# EAGLE design X13_Power_Distribution (EAGLE 9.6.2)
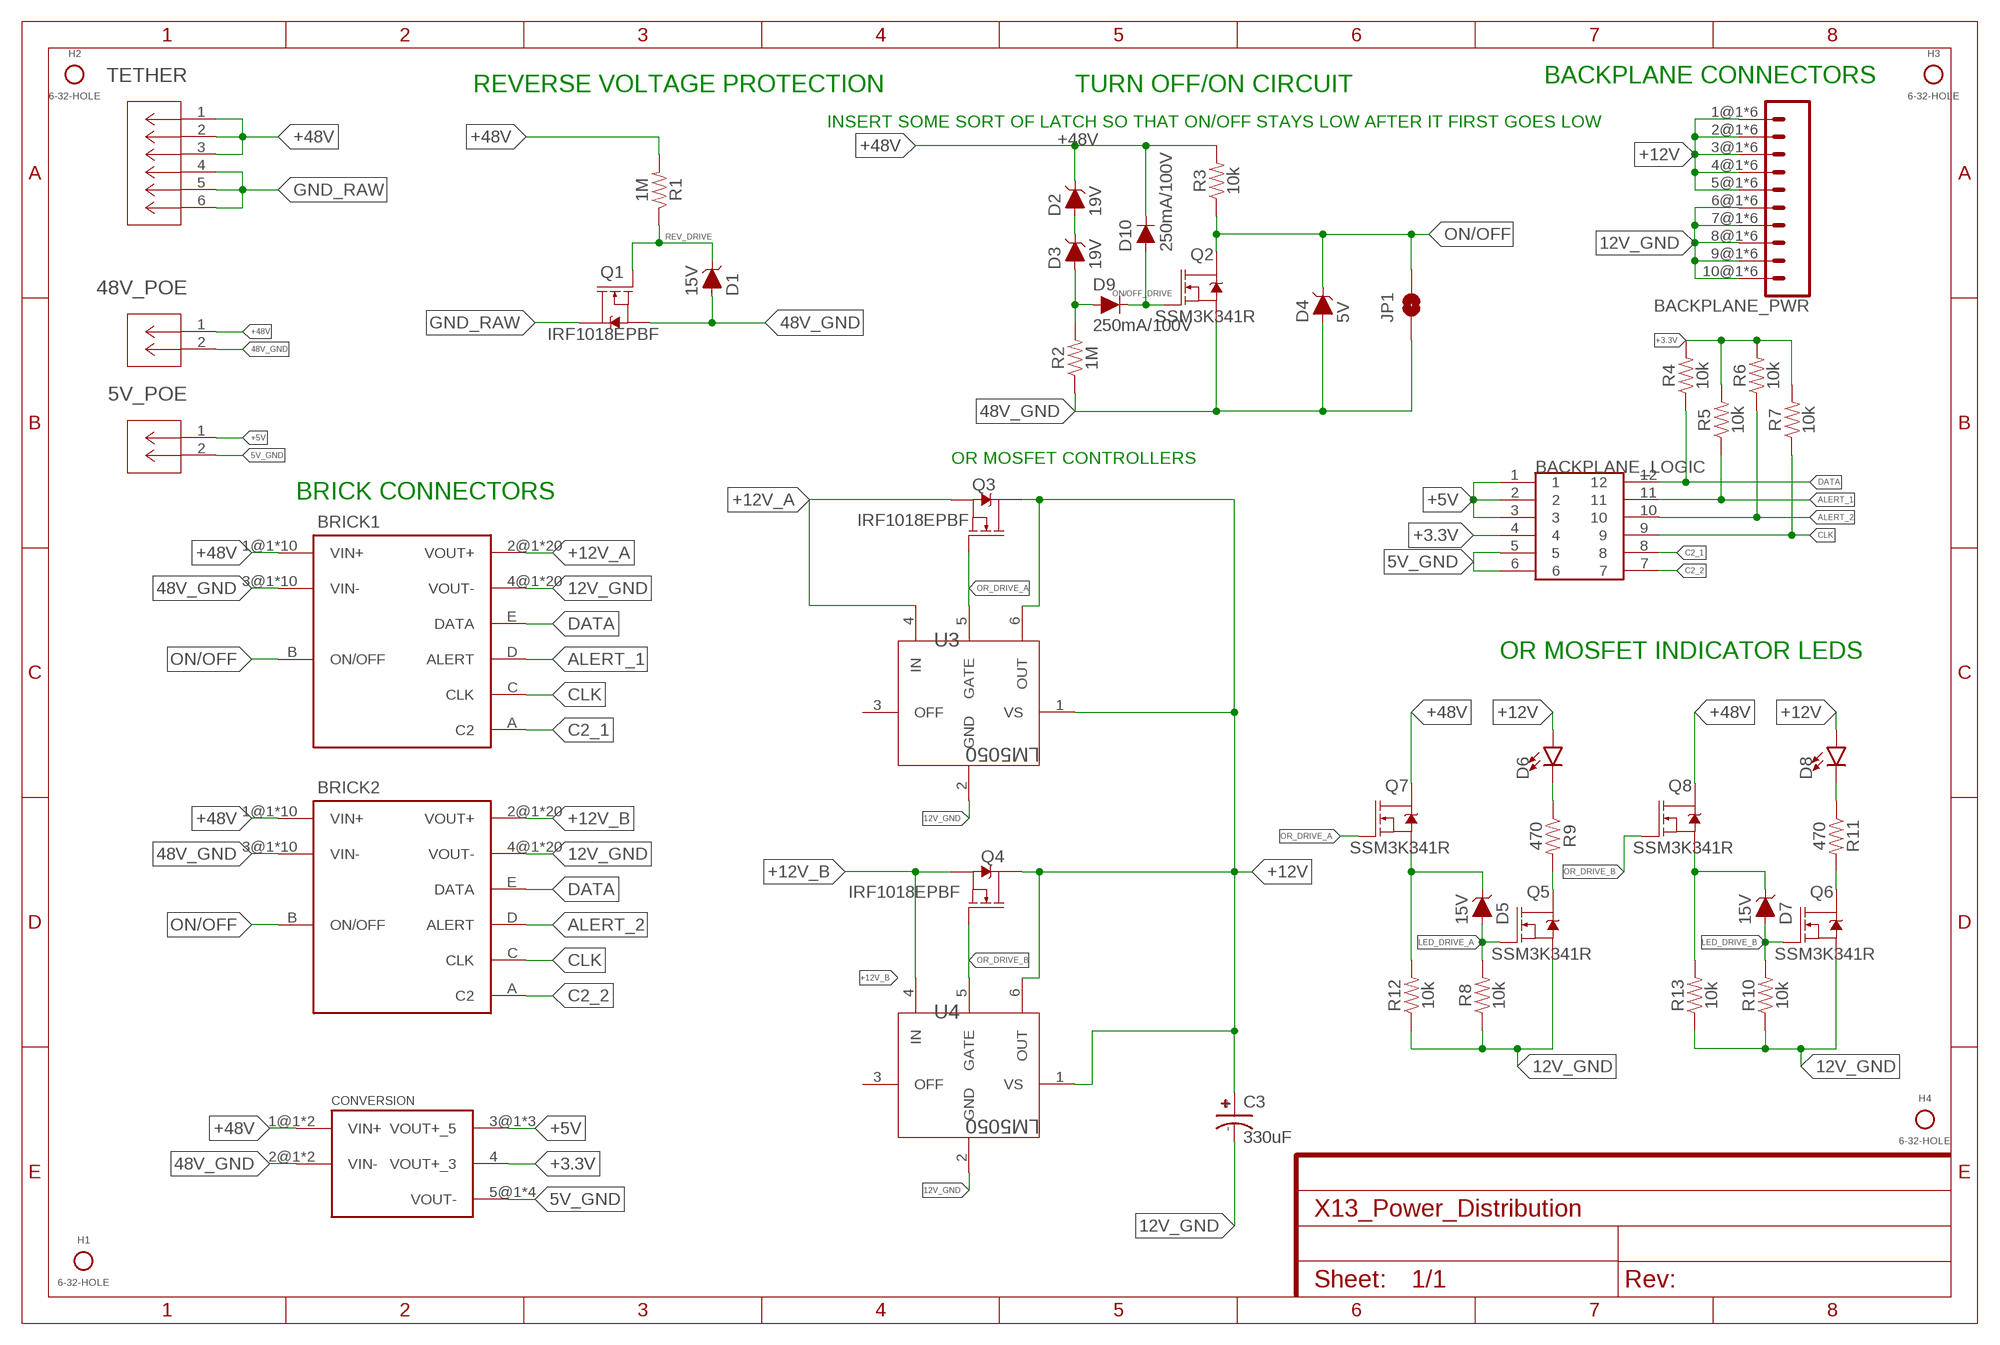
[diagram p0: schematic, sheet 1, part 1 of 2]
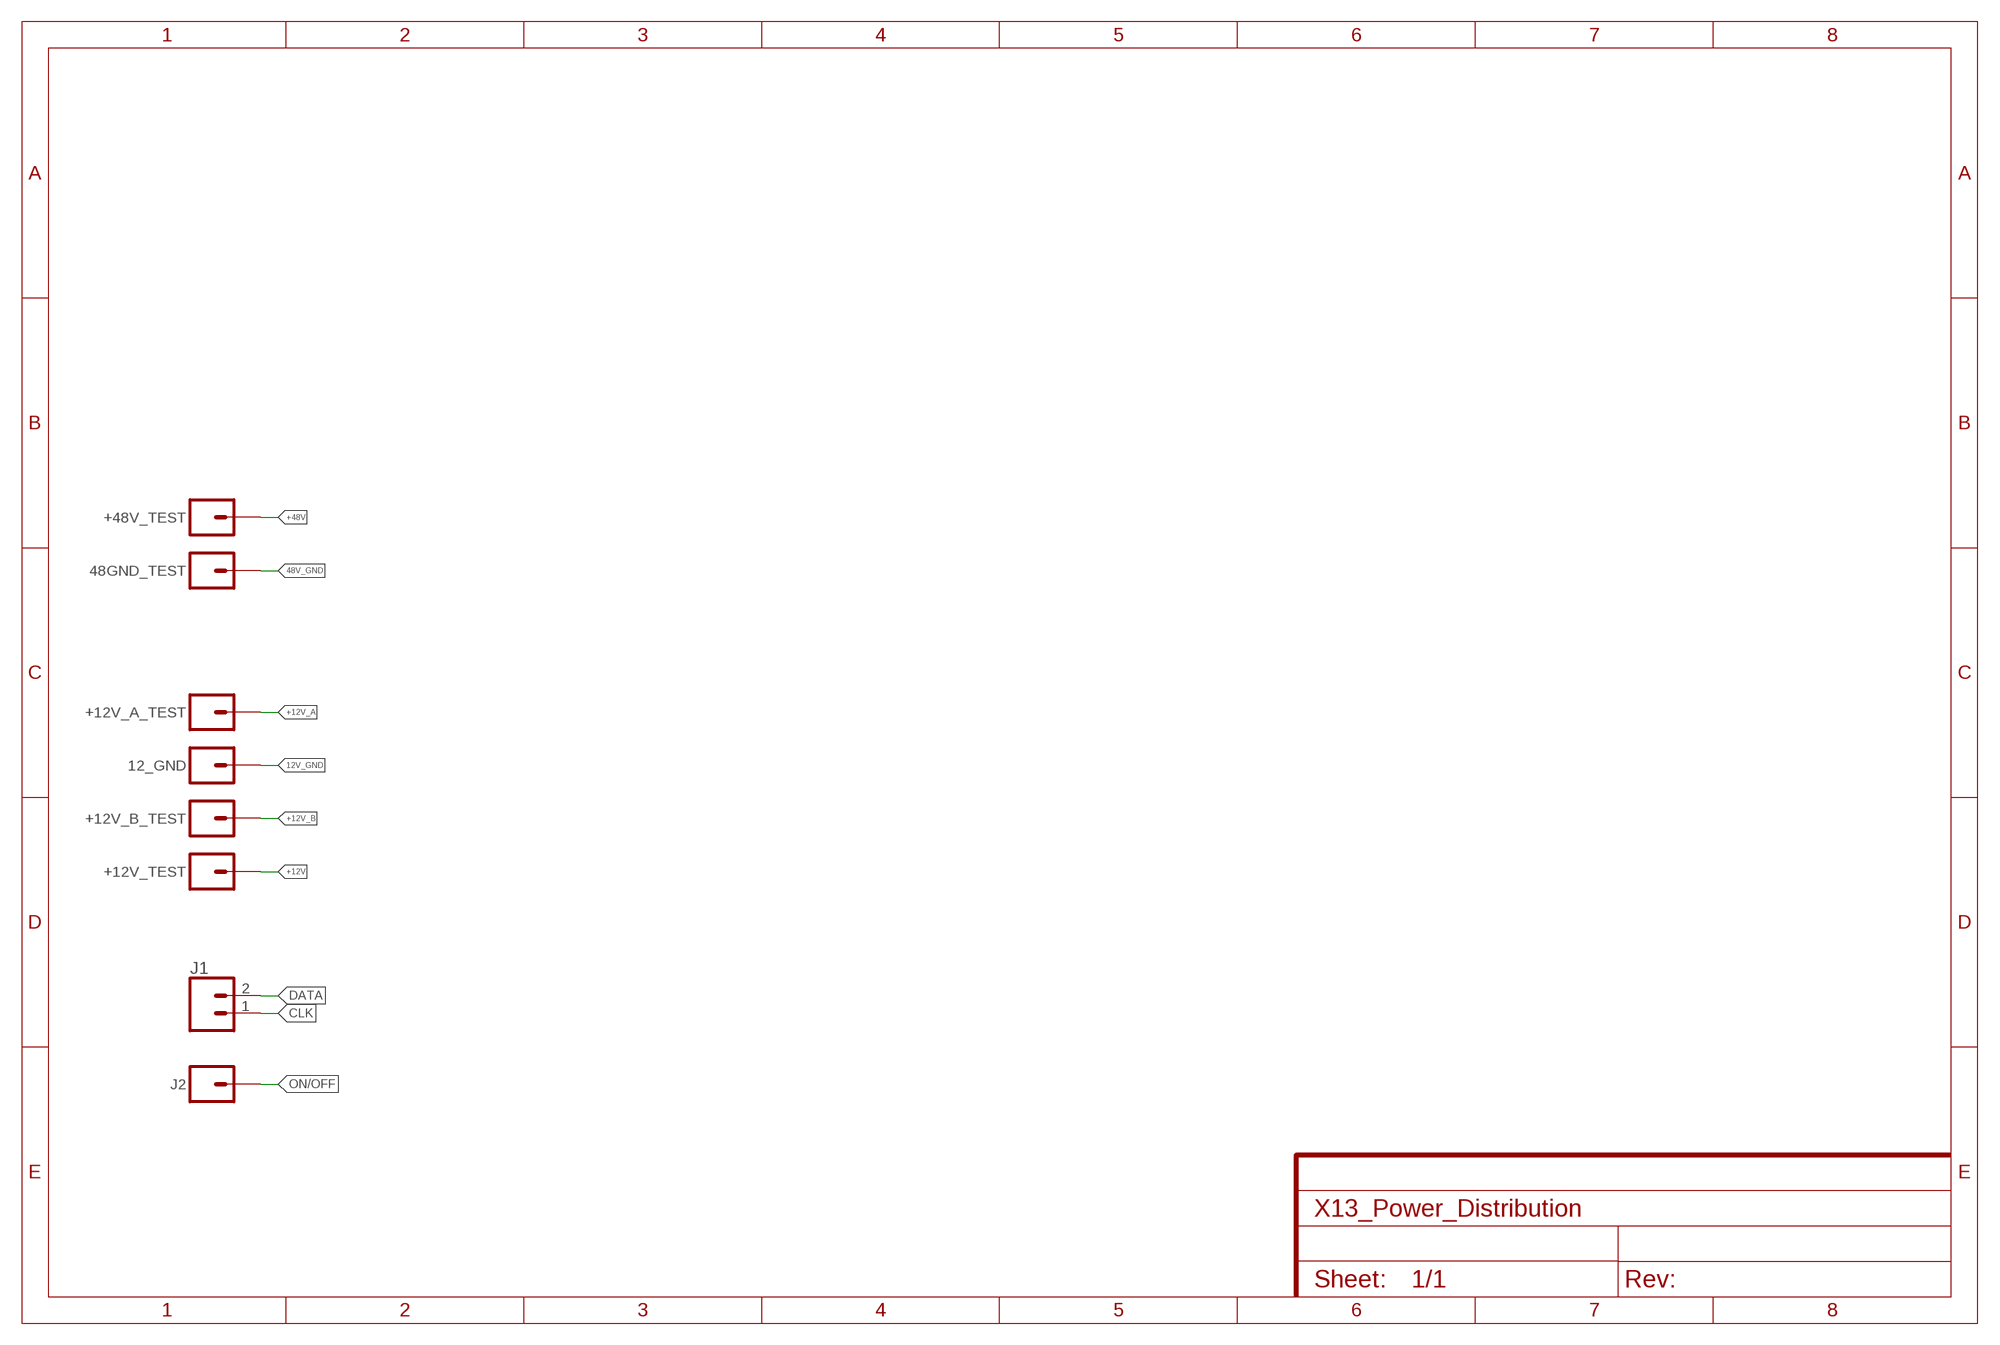
[diagram p1: schematic, sheet 1, part 2 of 2]

## Parts
5V_POE  POE_TERMINAL  [CONN2_282834-2_TEC]
12_GND  CONN_01  [1X01]
48GND_TEST  CONN_01  [1X01]
48V_POE  POE_TERMINAL  [CONN2_282834-2_TEC]
+12V_A_TEST  CONN_01  [1X01]
+12V_B_TEST  CONN_01  [1X01]
+12V_TEST  CONN_01  [1X01]
+48V_TEST  CONN_01  [1X01]
BACKPLANE_LOGIC  IPL1-106-01-L-D-K  [IPL1-106-01-L-D-K]
BACKPLANE_PWR  MPPT-10-01-01-L-RA-SD  [MPPT-10-01-01-L-RA-SD]
BRICK1  DIST2BRICKVER_D2  [DIST2BRICK_D2]
BRICK2  DIST2BRICKVER_D2  [DIST2BRICK_D2]
C3  330uF  UCM1H331MNL1GS  [CAPAE1030X1050N]
CONVERSION  DIST2CON  [DIST2CON]
D1  15V  DIODE-ZENER-BZT52C3V6S  [SOD-323]
D2  19V  DIODE-ZENER-BZT52C3V6S  [SOD-323]
D3  19V  DIODE-ZENER-BZT52C3V6S  [SOD-323]
D4  5V  DIODE-ZENER-BZT52C3V6S  [SOD-323]
D5  15V  DIODE-ZENER-BZT52C3V6S  [SOD-323]
D6  LED0603  [LED-0603]
D7  15V  DIODE-ZENER-BZT52C3V6S  [SOD-323]
D8  LED0603  [LED-0603]
D9  250mA/100V  DIODE-BAS16J  [SOD-323]
D10  250mA/100V  DIODE-BAS16J  [SOD-323]
H1  6-32-HOLE  [6-32-HOLE]
H2  6-32-HOLE  [6-32-HOLE]
H3  6-32-HOLE  [6-32-HOLE]
H4  6-32-HOLE  [6-32-HOLE]
J1  CONN_02  [1X02]
J2  CONN_01  [1X01]
JP1  JUMPER-SMT_2_NO_SILK  [SMT-JUMPER_2_NO_SILK]
Q1  IRF1018EPBF  [TO263]
Q2  SSM3K341R  MOSFET-NCH-2N7002PW  [SOT323]
Q3  IRF1018EPBF  [TO263]
Q4  IRF1018EPBF  [TO263]
Q5  SSM3K341R  MOSFET-NCH-2N7002PW  [SOT323]
Q6  SSM3K341R  MOSFET-NCH-2N7002PW  [SOT323]
Q7  SSM3K341R  MOSFET-NCH-2N7002PW  [SOT323]
Q8  SSM3K341R  MOSFET-NCH-2N7002PW  [SOT323]
R1  1M  RESISTOR0603  [0603]
R2  1M  RESISTOR0603  [0603]
R3  10k  RESISTOR0603  [0603]
R4  10k  RESISTOR0603  [0603]
R5  10k  RESISTOR0603  [0603]
R6  10k  RESISTOR0603  [0603]
R7  10k  RESISTOR0603  [0603]
R8  10k  RESISTOR0603  [0603]
R9  470  RESISTOR0603  [0603]
R10  10k  RESISTOR0603  [0603]
R11  470  RESISTOR0603  [0603]
R12  10k  RESISTOR0603  [0603]
R13  10k  RESISTOR0603  [0603]
TETHER  48V  DIST_TO_TETHER  [CON6_P5MM_VER_TERM-BLK_TYC]
U3  LM5050  DIST_OR_CONTROL_ALTMK06A-M  [SOT-23-6]
U4  LM5050  DIST_OR_CONTROL_ALTMK06A-M  [SOT-23-6]

## Nets
5V_GND: 5V_POE.2 BACKPLANE_LOGIC.5 BACKPLANE_LOGIC.6 CONVERSION.5@1(VOUT-) CONVERSION.5@2(VOUT-) CONVERSION.5@3(VOUT-) CONVERSION.5@4(VOUT-)
12V_GND: 12_GND.1 BACKPLANE_PWR.6@1 BACKPLANE_PWR.6@2 BACKPLANE_PWR.6@3 BACKPLANE_PWR.6@4 BACKPLANE_PWR.6@5 BACKPLANE_PWR.6@6 BACKPLANE_PWR.7@1 BACKPLANE_PWR.7@2 BACKPLANE_PWR.7@3 BACKPLANE_PWR.7@4 BACKPLANE_PWR.7@5 BACKPLANE_PWR.7@6 BACKPLANE_PWR.8@1 BACKPLANE_PWR.8@2 BACKPLANE_PWR.8@3 BACKPLANE_PWR.8@4 BACKPLANE_PWR.8@5 BACKPLANE_PWR.8@6 BACKPLANE_PWR.9@1 BACKPLANE_PWR.9@2 BACKPLANE_PWR.9@3 BACKPLANE_PWR.9@4 BACKPLANE_PWR.9@5 BACKPLANE_PWR.9@6 BACKPLANE_PWR.10@1 BACKPLANE_PWR.10@2 BACKPLANE_PWR.10@3 BACKPLANE_PWR.10@4 BACKPLANE_PWR.10@5 BACKPLANE_PWR.10@6 BRICK1.4@1(VOUT-) BRICK1.4@2(VOUT-) BRICK1.4@3(VOUT-) BRICK1.4@4(VOUT-) BRICK1.4@5(VOUT-) BRICK1.4@6(VOUT-) BRICK1.4@7(VOUT-) BRICK1.4@8(VOUT-) BRICK1.4@9(VOUT-) BRICK1.4@10(VOUT-) BRICK1.4@11(VOUT-) BRICK1.4@12(VOUT-) BRICK1.4@13(VOUT-) BRICK1.4@14(VOUT-) BRICK1.4@15(VOUT-) BRICK1.4@16(VOUT-) BRICK1.4@17(VOUT-) BRICK1.4@18(VOUT-) BRICK1.4@19(VOUT-) BRICK1.4@20(VOUT-) BRICK2.4@1(VOUT-) BRICK2.4@2(VOUT-) BRICK2.4@3(VOUT-) BRICK2.4@4(VOUT-) BRICK2.4@5(VOUT-) BRICK2.4@6(VOUT-) BRICK2.4@7(VOUT-) BRICK2.4@8(VOUT-) BRICK2.4@9(VOUT-) BRICK2.4@10(VOUT-) BRICK2.4@11(VOUT-) BRICK2.4@12(VOUT-) BRICK2.4@13(VOUT-) BRICK2.4@14(VOUT-) BRICK2.4@15(VOUT-) BRICK2.4@16(VOUT-) BRICK2.4@17(VOUT-) BRICK2.4@18(VOUT-) BRICK2.4@19(VOUT-) BRICK2.4@20(VOUT-) C3.- Q5.2(S) Q6.2(S) R8.1 R10.1 R12.1 R13.1 U3.2(GND) U4.2(GND)
48V_GND: 48GND_TEST.1 48V_POE.2 BRICK1.3@1(VIN-) BRICK1.3@2(VIN-) BRICK1.3@3(VIN-) BRICK1.3@4(VIN-) BRICK1.3@5(VIN-) BRICK1.3@6(VIN-) BRICK1.3@7(VIN-) BRICK1.3@8(VIN-) BRICK1.3@9(VIN-) BRICK1.3@10(VIN-) BRICK2.3@1(VIN-) BRICK2.3@2(VIN-) BRICK2.3@3(VIN-) BRICK2.3@4(VIN-) BRICK2.3@5(VIN-) BRICK2.3@6(VIN-) BRICK2.3@7(VIN-) BRICK2.3@8(VIN-) BRICK2.3@9(VIN-) BRICK2.3@10(VIN-) CONVERSION.2@1(VIN-) CONVERSION.2@2(VIN-) D1.A D4.A JP1.1 Q1.2(S) Q2.2(S) R2.1
+3.3V: BACKPLANE_LOGIC.4 CONVERSION.4(VOUT+_3) R4.2 R5.2 R6.2 R7.2
+5V: 5V_POE.1 BACKPLANE_LOGIC.1 BACKPLANE_LOGIC.2 BACKPLANE_LOGIC.3 CONVERSION.3@1(VOUT+_5) CONVERSION.3@2(VOUT+_5) CONVERSION.3@3(VOUT+_5)
+12V: +12V_TEST.1 BACKPLANE_PWR.1@1 BACKPLANE_PWR.1@2 BACKPLANE_PWR.1@3 BACKPLANE_PWR.1@4 BACKPLANE_PWR.1@5 BACKPLANE_PWR.1@6 BACKPLANE_PWR.2@1 BACKPLANE_PWR.2@2 BACKPLANE_PWR.2@3 BACKPLANE_PWR.2@4 BACKPLANE_PWR.2@5 BACKPLANE_PWR.2@6 BACKPLANE_PWR.3@1 BACKPLANE_PWR.3@2 BACKPLANE_PWR.3@3 BACKPLANE_PWR.3@4 BACKPLANE_PWR.3@5 BACKPLANE_PWR.3@6 BACKPLANE_PWR.4@1 BACKPLANE_PWR.4@2 BACKPLANE_PWR.4@3 BACKPLANE_PWR.4@4 BACKPLANE_PWR.4@5 BACKPLANE_PWR.4@6 BACKPLANE_PWR.5@1 BACKPLANE_PWR.5@2 BACKPLANE_PWR.5@3 BACKPLANE_PWR.5@4 BACKPLANE_PWR.5@5 BACKPLANE_PWR.5@6 C3.+ D6.A D8.A Q3.3(D) Q4.3(D) U3.1(VS) U3.6(OUT) U4.1(VS) U4.6(OUT)
+12V_A: +12V_A_TEST.1 BRICK1.2@1(VOUT+) BRICK1.2@2(VOUT+) BRICK1.2@3(VOUT+) BRICK1.2@4(VOUT+) BRICK1.2@5(VOUT+) BRICK1.2@6(VOUT+) BRICK1.2@7(VOUT+) BRICK1.2@8(VOUT+) BRICK1.2@9(VOUT+) BRICK1.2@10(VOUT+) BRICK1.2@11(VOUT+) BRICK1.2@12(VOUT+) BRICK1.2@13(VOUT+) BRICK1.2@14(VOUT+) BRICK1.2@15(VOUT+) BRICK1.2@16(VOUT+) BRICK1.2@17(VOUT+) BRICK1.2@18(VOUT+) BRICK1.2@19(VOUT+) BRICK1.2@20(VOUT+) Q3.2(S) U3.4(IN)
+12V_B: +12V_B_TEST.1 BRICK2.2@1(VOUT+) BRICK2.2@2(VOUT+) BRICK2.2@3(VOUT+) BRICK2.2@4(VOUT+) BRICK2.2@5(VOUT+) BRICK2.2@6(VOUT+) BRICK2.2@7(VOUT+) BRICK2.2@8(VOUT+) BRICK2.2@9(VOUT+) BRICK2.2@10(VOUT+) BRICK2.2@11(VOUT+) BRICK2.2@12(VOUT+) BRICK2.2@13(VOUT+) BRICK2.2@14(VOUT+) BRICK2.2@15(VOUT+) BRICK2.2@16(VOUT+) BRICK2.2@17(VOUT+) BRICK2.2@18(VOUT+) BRICK2.2@19(VOUT+) BRICK2.2@20(VOUT+) Q4.2(S) U4.4(IN)
+48V: 48V_POE.1 +48V_TEST.1 BRICK1.1@1(VIN+) BRICK1.1@2(VIN+) BRICK1.1@3(VIN+) BRICK1.1@4(VIN+) BRICK1.1@5(VIN+) BRICK1.1@6(VIN+) BRICK1.1@7(VIN+) BRICK1.1@8(VIN+) BRICK1.1@9(VIN+) BRICK1.1@10(VIN+) BRICK2.1@1(VIN+) BRICK2.1@2(VIN+) BRICK2.1@3(VIN+) BRICK2.1@4(VIN+) BRICK2.1@5(VIN+) BRICK2.1@6(VIN+) BRICK2.1@7(VIN+) BRICK2.1@8(VIN+) BRICK2.1@9(VIN+) BRICK2.1@10(VIN+) CONVERSION.1@1(VIN+) CONVERSION.1@2(VIN+) D2.C D10.C Q7.3(D) Q8.3(D) R1.2 R3.2 TETHER.1 TETHER.2 TETHER.3
ALERT_1: BACKPLANE_LOGIC.11 BRICK1.D(ALERT) R5.1
ALERT_2: BACKPLANE_LOGIC.10 BRICK2.D(ALERT) R6.1
C2_1: BACKPLANE_LOGIC.8 BRICK1.A(C2)
C2_2: BACKPLANE_LOGIC.7 BRICK2.A(C2)
CLK: BACKPLANE_LOGIC.9 BRICK1.C(CLK) BRICK2.C(CLK) J1.1 R7.1
DATA: BACKPLANE_LOGIC.12 BRICK1.E(DATA) BRICK2.E(DATA) J1.2 R4.1
GND_RAW: Q1.3(D) TETHER.4 TETHER.5 TETHER.6
LED_DRIVE_A: D5.A Q5.1(G) R8.2
LED_DRIVE_B: D7.A Q6.1(G) R10.2
N$1: D2.A D3.C
N$2: D5.C Q7.2(S) R12.2
N$3: D7.C Q8.2(S) R13.2
N$4: Q5.3(D) R9.2
N$5: D6.C R9.1
N$6: Q6.3(D) R11.2
N$7: D8.C R11.1
ON/OFF: BRICK1.B(ON/OFF) BRICK2.B(ON/OFF) D4.C J2.1 JP1.2 Q2.3(D) R3.1
ON/OFF_DRIVE: D9.C D10.A Q2.1(G)
ON_DETECT: D3.A D9.A R2.2
OR_DRIVE_A: Q3.1(G) Q7.1(G) U3.5(GATE)
OR_DRIVE_B: Q4.1(G) Q8.1(G) U4.5(GATE)
REV_DRIVE: D1.C Q1.1(G) R1.1
Unconnected: U3.3(OFF) U4.3(OFF)

## Notes on the sheet
- BACKPLANE CONNECTORS
- REVERSE VOLTAGE PROTECTION | TURN OFF/ON CIRCUIT
- INSERT SOME SORT OF LATCH SO THAT ON/OFF STAYS LOW AFTER IT FIRST GOES LOW
- OR MOSFET CONTROLLERS
- BRICK CONNECTORS
- OR MOSFET INDICATOR LEDS

## Library data of the parts
5V_POE 48V_POE = Dist_POE:POE_TERMINAL; BUILT_BY: EMA_UL_Team; COPYRIGHT: Copyright (C) 2016 Accelerated Designs. All rights reserved; DESCRIPTION: TERMI-BLOK PCB MOUNT, 90 2P.; MANUFACTURER_PART_NUMBER: 282834-2; PITCH_MM_: 2.54; POSITIONS: 2; PRODUCT: Terminal Block Headers & Receptacles; ROWS-CONFIG: 1; SOURCELIBRARY: TE_Connectivity-2018-03-16; TE_PART_NUMBER: 282834-2; TYPE: Receptacle; VENDOR: TE Connectivity
12_GND 48GND_TEST +12V_A_TEST +12V_B_TEST +12V_TEST +48V_TEST J2 = SparkFun-Connectors:CONN_01: Single connection point. Often used as Generic Header-pin footprint for 0.1 inch spaced/style header connections On any of the 0.1 inch spaced packages, you can populate with these: Break Away Headers - Straight <https://www.sparkfun.com/products/116> (PRT-00116) Break Away Male Headers - Right Angle <https://www.sparkfun.com/products/553> (PRT-00553) Female Headers <https://www.sparkfun.com/products/115> (PRT-00115) Break Away Headers - Machine Pin <https://www.sparkfun.com/products/117> (PRT-00117) Break Away Female Headers - Swiss Machine Pin <https://www.sparkfun.com/products/743> (PRT-00743) This device is also useful as a general connection point to wire up your design to another part of your project. Our various solder wires solder well into these plated through hole pads. Hook-Up Wire - Assortment (Stranded, 22 AWG) <https://www.sparkfun.com/products/11375> (PRT-11375) Hook-Up Wire - Assortment (Solid Core, 22 AWG) <https://www.sparkfun.com/products/11367> (PRT-11367) View the entire wire category on our website here <https://www.sparkfun.com/categories/141> Special notes: SMTSO-256-ET is a "flush mount" nut for a 4-40 screw. We mostly use this on specialty testbeds; it is a nice way to connect hardware to your PCB at an adjustable hieght. Also note, the SNAP packages are for using a snappable style connector. We sell a baggie of snaps and they are also used on two LilyPad designs: Snap Assortment - 30 pack (male and female) <https://www.sparkfun.com/products/11347> (DEV-11347) LilyPad Arduino SimpleSnap <https://www.sparkfun.com/products/10941> (DEV-10941) LilyPad SimpleSnap Protoboard <https://www.sparkfun.com/products/10940> (DEV-10940)
BACKPLANE_LOGIC = Backplane_Dist_Logic_Connector:IPL1-106-01-L-D-K
BACKPLANE_PWR = Samtec MPPT Hermaphoditic 10 pos - MPPT-10-01-01-L-RA-SD:MPPT-10-01-01-L-RA-SD: Samtec MPPT Connector Right Angle Vertically mating Non-gendered https://www.samtec.com/products/mppt-10-01-01-l-ra-sd
BRICK1 BRICK2 = Brick_Dist_Connector:DIST2BRICK
C3 = brick-capacitor-UCM1H331MNL1GS:UCM1H331MNL1GS: Nichicon 330uF 50 V Aluminium Electrolytic Capacitor SMD, CM Series 2000h 10 (Dia.) x 10mm Source: Datasheet <http://www.nichicon.co.jp/english/products/pdfs/e-ucm.pdf>; ARROW_PART_NUMBER: UCM1H331MNL1GS; ARROW_PRICE-STOCK: https://www.arrow.com/en/products/ucm1h331mnl1gs/nichicon; DESCRIPTION: Nichicon 330uF 50 V Aluminium Electrolytic Capacitor SMD, CM Series 2000h 10 (Dia.) x 10mm; HEIGHT: 10.5mm; MANUFACTURER_NAME: Nichicon; MANUFACTURER_PART_NUMBER: UCM1H331MNL1GS; MOUSER_PART_NUMBER: 647-UCM1H331MNL1GS; MOUSER_PRICE-STOCK: https://www.mouser.co.uk/ProductDetail/Nichicon/UCM1H331MNL1GS?qs=DSgADHjnLTkTovFLdbC%252BNg%3D%3D
CONVERSION = Dist_Convert_Connector:DIST2CON
D1-D5 D7 = SparkFun-DiscreteSemi:DIODE-ZENER: Zener Diode A Zener diode allows current to flow from its anode to its cathode like a normal semiconductor diode, but it also permits current to flow in the reverse direction when its "Zener voltage" is reached. - WIkipedia; PROD_ID: DIO-08199; VALUE: 3.6V
D6 D8 = SparkFun-LED:LED: LED (Generic) Standard schematic elements and footprints for 5mm, 3mm, 1206, and 0603 sized LEDs. Generic LEDs with no color specified.
D9 D10 = SparkFun-DiscreteSemi:DIODE: Diode These are standard reverse protection diodes and small signal diodes. SparkFun Products: SparkFun SparkPunk Sound Kit <https://www.sparkfun.com/products/11177> SparkFun ESP8266 Thing <https://www.sparkfun.com/products/13231>; PROD_ID: DIO-09646
H1-H4 = Mounting Holes:6-32-HOLE
J1 = SparkFun-Connectors:CONN_02: Multi connection point. Often used as Generic Header-pin footprint for 0.1 inch spaced/style header connections On any of the 0.1 inch spaced packages, you can populate with these: Break Away Headers - Straight <https://www.sparkfun.com/products/116> (PRT-00116) Break Away Male Headers - Right Angle <https://www.sparkfun.com/products/553> (PRT-00553) Female Headers <https://www.sparkfun.com/products/115> (PRT-00115) Break Away Headers - Machine Pin <https://www.sparkfun.com/products/117> (PRT-00117) Break Away Female Headers - Swiss Machine Pin <https://www.sparkfun.com/products/743> (PRT-00743) For SCREWTERMINALS and SPRING TERMINALS visit here: Screw Terimnals on SparkFun.com <https://www.sparkfun.com/search/results?term=Screw+Terminals> (5mm/3.5mm/2.54mm spacing) This device is also useful as a general connection point to wire up your design to another part of your project. Our various solder wires solder well into these plated through hole pads. Hook-Up Wire - Assortment (Stranded, 22 AWG) <https://www.sparkfun.com/products/11375> (PRT-11375) Hook-Up Wire - Assortment (Solid Core, 22 AWG) <https://www.sparkfun.com/products/11367> (PRT-11367) View the entire wire category on our website here <https://www.sparkfun.com/categories/141> Special notes: Molex polarized connector foot print use with: PRT-08233 with associated crimp pins and housings. 2.54_SCREWTERM for use with PRT-10571. 3.5mm Screw Terminal footprints for PRT-08084 5mm Screw Terminal footprints for use with PRT-08432
JP1 = SparkFun-Jumpers:JUMPER-SMT_2_NO: Normally open jumper This jumper has two pads in close proximity to each other. Apply solder to close the connection. Round pads are easier to solder for beginners, but are a lot larger. SparkFun Product that uses the round pads: SparkFun EL Sequencer <https://www.sparkfun.com/products/12781>
Q1 Q3 Q4 = Dist_Reverse_Voltage_NMOS:IRF1018EPBF
Q2 Q5-Q8 = SparkFun-DiscreteSemi:MOSFET-NCH: N-channel MOSFETs Voltage controlled devices that allow control of high current outputs. SparkFun Products: SparkFun OpenScale <https://www.sparkfun.com/products/13261> SparkFun Digital Sandbox <https://www.sparkfun.com/products/12651> SparkFun Monster Moto Shield <https://www.sparkfun.com/products/10182> SparkFun MOSFET Power Controller <https://www.sparkfun.com/products/11214>; PROD_ID: TRANS-11151; VALUE: 310mA/60V/1.6Ω
R1 R4-R7 R9 R11 = SparkFun-Resistors:RESISTOR: Generic Resistor Package
R2 R3 R8 R10 R12 R13 = SparkFun-Resistors:RESISTOR: Generic Resistor Package; SPICEPREFIX: R
TETHER = Dist_To_Tether_Connector:DIST_TO_TETHER; BUILT_BY: EMA_UL_Team; MANUFACTURER_PART_NUMBER: 796636-6; SOURCELIBRARY: Tyco_2012-04-26; VENDOR: TE Connectivity
U3 U4 = Dist_OR_Controller:DIST_OR_CONTROL_ALT; BASEPN: LM5050-1; DATASHEETURL: http://www.ti.com/lit/ds/symlink/lm5050-1.pdf; DESCRIPTION: High Side OR-ing FET Controller; MANUFACTURER: Texas Instruments; MANUFACTURER_PART_NUMBER: LM5050MK-1/NOPB; NSC_PACKAGEREFERENCE: MK06A; VENDOR: Texas Instruments

## Net classes
0 default: width 0.203 mm, clearance 0.205 mm

## Board
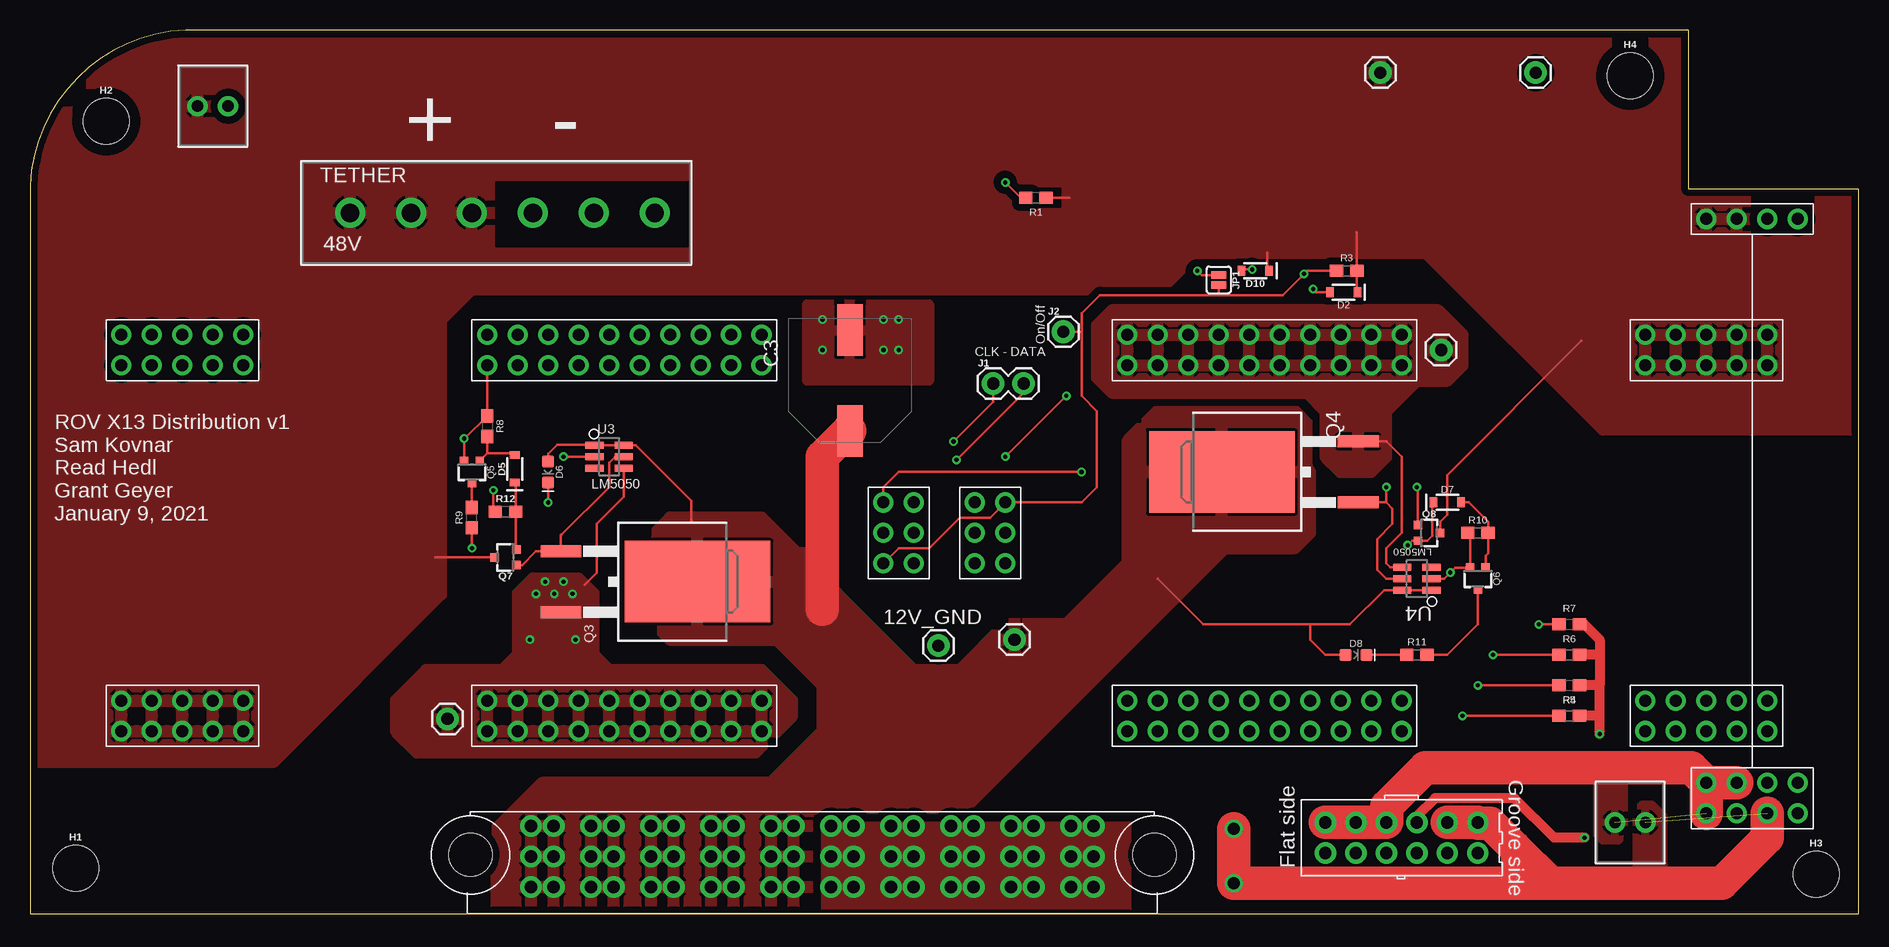
[diagram p2: board, top side]
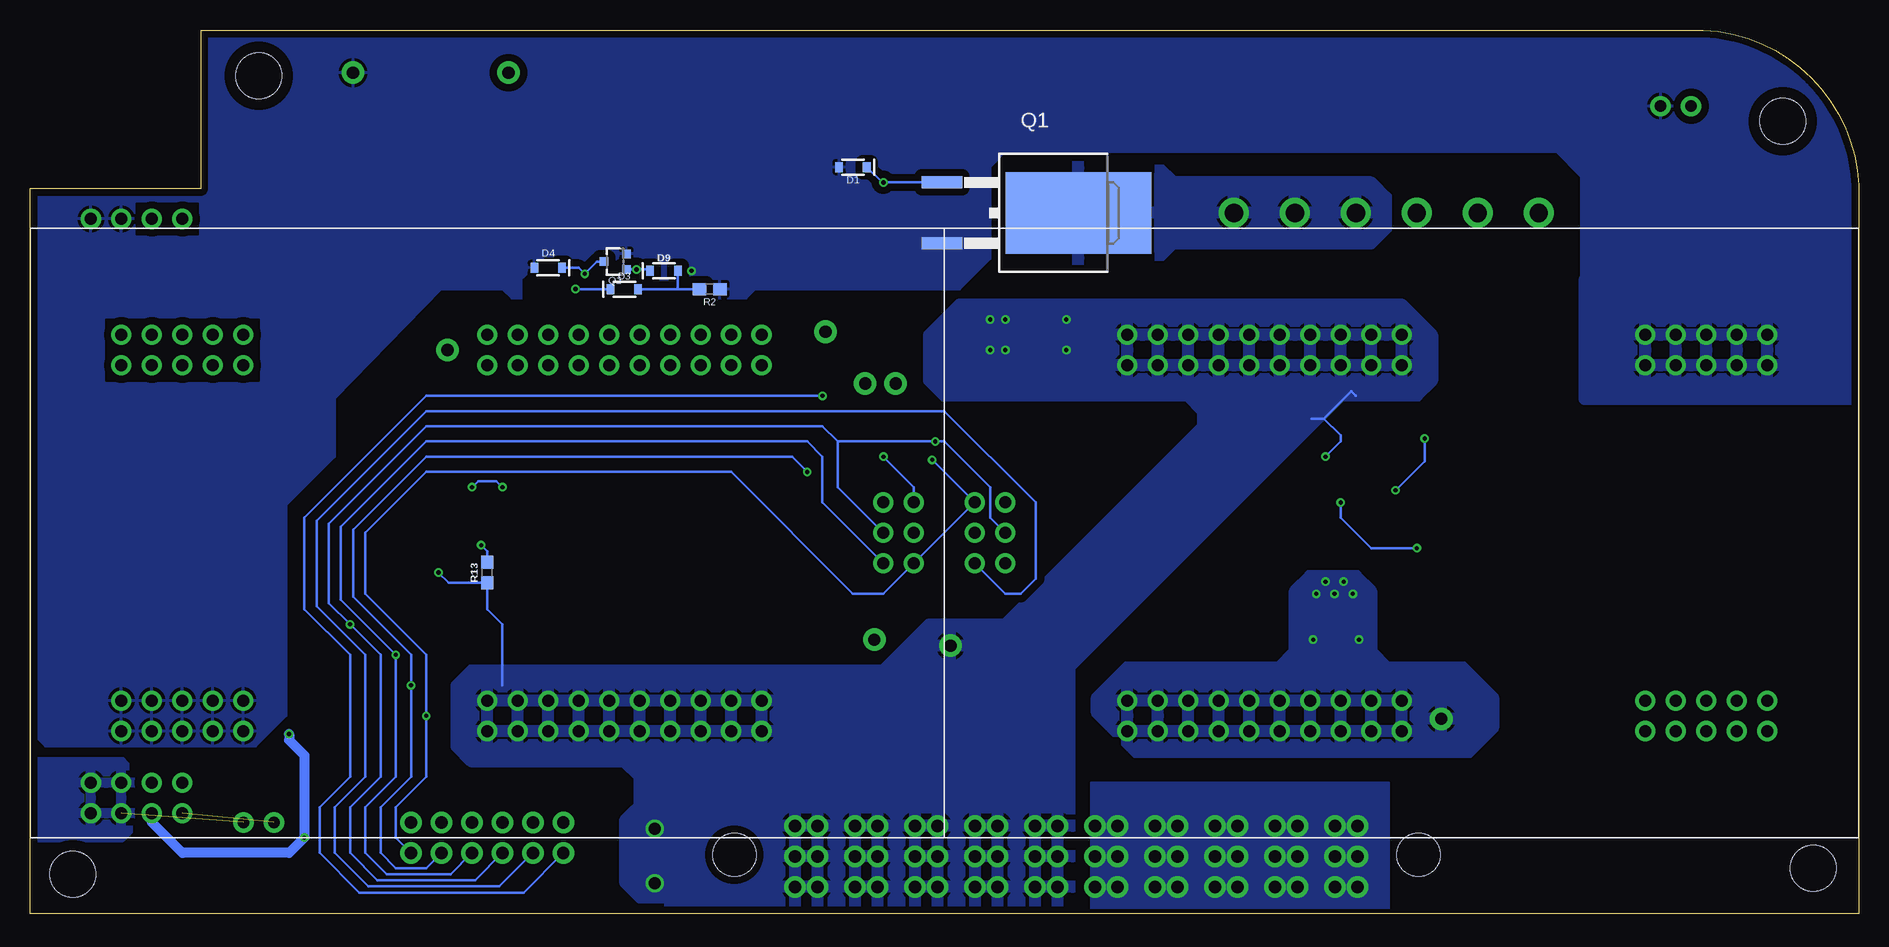
[diagram p3: board, bottom side, seen from below]

Size 152.4 x 73.66 mm. Coordinates in mm from the lower left corner, seen from the top.
Outline: 0,0 152.4,0 152.4,60.45 138.18,60.45 138.18,73.66 14.22,73.66 arc90 0,60.71 0,0
Copper layers (1*16): Top 0.0356mm / dielectric 1.5011mm / Bottom 0.0356mm
Design rules "ECE_Senior_Design": minimum track width 8mil, minimum drill 13mil, track to track 8mil, track to pad 8mil, pad to pad 6mil, via to via 8mil, smd to smd 6mil, copper to edge 15mil, drill to drill 8mil, minimum pad ring 7mil, minimum via ring 7mil, stop-mask expansion 3mil, vias tented up to drill 0mil, thermal gap 10mil

### Footprints (pad centres in the part's own frame; a part is rotated, then mirrored left to right if it is on the bottom)
CONN2_282834-2_TEC = drill 0.965 pad 1.7: 1 0,0; 2 2.54,0
1X01 = drill 1.016 pad 1.88: 1 0,0
IPL1-106-01-L-D-K = drill 1.016 pad 1.778: 1 0,0; 2 2.54,0; 3 5.08,0; 4 7.62,0; 5 10.16,0; 6 12.7,0; 7 0,-2.54; 8 2.54,-2.54; 9 5.08,-2.54; 10 7.62,-2.54; 11 10.16,-2.54; 12 12.7,-2.54
MPPT-10-01-01-L-RA-SD = drill 1.04 pad 1.8: 1@1 -23.44,2.26; 1@2 -21.56,2.26; 1@3 -23.44,4.8; 1@4 -21.56,4.8; 1@5 -23.44,7.34; 1@6 -21.56,7.34; 2@1 -18.44,2.26; 2@2 -16.56,2.26; 2@3 -18.44,4.8; 2@4 -16.56,4.8; 2@5 -18.44,7.34; 2@6 -16.56,7.34; 3@1 -13.44,2.26; 3@2 -11.56,2.26; 3@3 -13.44,4.8; 3@4 -11.56,4.8; 3@5 -13.44,7.34; 3@6 -11.56,7.34; 4@1 -8.44,2.26; 4@2 -6.56,2.26; 4@3 -8.44,4.8; 4@4 -6.56,4.8; 4@5 -8.44,7.34; 4@6 -6.56,7.34; 5@1 -3.44,2.26; 5@2 -1.56,2.26; 5@3 -3.44,4.8; 5@4 -1.56,4.8; 5@5 -3.44,7.34; 5@6 -1.56,7.34; 6@1 1.56,2.26; 6@2 3.44,2.26; 6@3 1.56,4.8; 6@4 3.44,4.8; 6@5 1.56,7.34; 6@6 3.44,7.34; 7@1 6.56,2.26; 7@2 8.44,2.26; 7@3 6.56,4.8; 7@4 8.44,4.8; 7@5 6.56,7.34; 7@6 8.44,7.34; 8@1 11.56,2.26; 8@2 13.44,2.26; 8@3 11.56,4.8; 8@4 13.44,4.8; 8@5 11.56,7.34; 8@6 13.44,7.34; 9@1 16.56,2.26; 9@2 18.44,2.26; 9@3 16.56,4.8; 9@4 18.44,4.8; 9@5 16.56,7.34; 9@6 18.44,7.34; 10@1 21.56,2.26; 10@2 23.44,2.26; 10@3 21.56,4.8; 10@4 23.44,4.8; 10@5 21.56,7.34; 10@6 23.44,7.34 | hole 3.6: 28.5,4.93; -28.5,4.93
DIST2BRICK_D2 = drill 1 pad 1.676: 1@1 -30.48,-16.51; 1@2 -30.48,-13.97; 1@3 -27.94,-16.51; 1@4 -27.94,-13.97; 1@5 -25.4,-16.51; 1@6 -25.4,-13.97; 1@7 -22.86,-16.51; 1@8 -22.86,-13.97; 1@9 -20.32,-16.51; 1@10 -20.32,-13.97; 2@1 0,-16.51; 2@2 0,-13.97; 2@3 2.54,-16.51; 2@4 2.54,-13.97; 2@5 5.08,-16.51; 2@6 5.08,-13.97; 2@7 7.62,-16.51; 2@8 7.62,-13.97; 2@9 10.16,-16.51; 2@10 10.16,-13.97; 2@11 12.7,-16.51; 2@12 12.7,-13.97; 2@13 15.24,-16.51; 2@14 15.24,-13.97; 2@15 17.78,-16.51; 2@16 17.78,-13.97; 2@17 20.32,-13.97; 2@18 22.86,-13.97; 2@19 22.86,-16.51; 2@20 20.32,-16.51; 3@1 -30.48,13.97; 3@2 -30.48,16.51; 3@3 -27.94,13.97; 3@4 -27.94,16.51; 3@5 -25.4,13.97; 3@6 -25.4,16.51; 3@7 -22.86,13.97; 3@8 -22.86,16.51; 3@9 -20.32,13.97; 3@10 -20.32,16.51; 4@1 0,13.97; 4@2 0,16.51; 4@3 2.54,13.97; 4@4 2.54,16.51; 4@5 5.08,13.97; 4@6 5.08,16.51; 4@7 7.62,13.97; 4@8 7.62,16.51; 4@9 10.16,13.97; 4@10 10.16,16.51; 4@11 12.7,13.97; 4@12 12.7,16.51; 4@13 15.24,13.97; 4@14 15.24,16.51; 4@15 17.78,13.97; 4@16 17.78,16.51; 4@17 20.32,16.51; 4@18 22.86,16.51; 4@19 22.86,13.97; 4@20 20.32,13.97; A 35.56,-2.54; B 33.02,-2.54; C 33.02,0; D 33.02,2.54; E 35.56,2.54; F 35.56,0
CAPAE1030X1050N = smd 4.3 x 2.15: + -4.2,0; - 4.2,0
DIST2CON = drill 1 pad 1.676: 1@1 -3.81,22.86; 1@2 -1.27,22.86; 2@1 1.27,22.86; 2@2 3.81,22.86; 3@1 -3.81,-26.67; 3@2 -3.81,-24.13; 3@3 -1.27,-24.13; 4 -1.27,-26.67; 5@1 1.27,-26.67; 5@2 1.27,-24.13; 5@3 3.81,-26.67; 5@4 3.81,-24.13
SOD-323 = smd 0.63 x 0.83: A 1.15,0; C -1.15,0
LED-0603 = smd 1 x 1: A -0.877,0; C 0.877,0
6-32-HOLE = hole 3.81: 0,0
1X02 = drill 1.016 pad 1.88: 1 0,0; 2 2.54,0
SMT-JUMPER_2_NO_SILK = smd 0.635 x 1.27: 1 -0.406,0; 2 0.406,0
TO263 = smd 3.4 x 1: 1 -6.552,2.54; 2 -6.552,-2.54 | smd 12.14 x 6.8: 3 4.818,0
SOT323 = smd 0.7 x 0.7: 1 -0.65,-0.925; 2 0.65,-0.925; 3 0,0.925
0603 = smd 1.1 x 1: 1 -0.85,0; 2 0.85,0
CON6_P5MM_VER_TERM-BLK_TYC = drill 1.524 pad 2.5: 1 0,0; 2 5.08,0; 3 10.16,0; 4 15.24,0; 5 20.32,0; 6 25.4,0
SOT-23-6 = smd 1.524 x 0.584: 1 -1.219,0.95; 2 -1.219,0; 3 -1.219,-0.95; 4 1.219,-0.95; 5 1.219,0; 6 1.219,0.95

### Placement (x,y rotation side)
5V_POE  132.08,7.62 0 top
12_GND  75.69,22.35 0 top
48GND_TEST  125.48,70.1 90 top
48V_POE  13.97,67.31 0 top
+12V_A_TEST  34.8,16.26 90 top
+12V_B_TEST  117.6,46.99 90 top
+12V_TEST  82.04,22.86 0 top
+48V_TEST  112.52,70.1 90 top
BACKPLANE_LOGIC  107.95,7.62 0 top
BACKPLANE_PWR  65.2,0 0 top
BRICK1  38.1,31.75 0 top
BRICK2  114.3,31.75 180 top
C3  68.33,44.45 90 top
CONVERSION  143.51,35.05 0 top
D1  83.82,62.23 180 bottom
D2  109.47,51.82 180 top
D3  102.87,52.07 0 bottom
D4  109.22,53.85 180 bottom
D5  40.39,37.08 90 top
D6  43.18,36.83 270 top
D7  118.11,34.29 0 top
D8  110.49,21.59 0 top
D9  99.57,53.59 0 bottom
D10  102.11,53.59 180 top
H1  3.81,3.81 0 top
H2  6.35,66.04 0 top
H3  148.84,3.3 0 top
H4  133.35,69.85 0 top
J1  80.26,44.2 0 top
J2  86.11,48.51 0 top
JP1  99.06,52.83 270 top
Q1  69.85,58.42 0 bottom
Q2  103.63,54.36 90 bottom
Q3  50.8,27.69 0 top
Q4  104.14,36.83 180 top
Q5  36.83,36.83 180 top
Q6  120.65,27.94 180 top
Q7  39.62,29.72 90 top
Q8  116.59,31.75 270 top
R1  83.82,59.69 0 top
R2  95.76,52.07 180 bottom
R3  109.73,53.59 0 top
R4  128.27,16.51 0 top
R5  128.27,19.05 0 top
R6  128.27,21.59 0 top
R7  128.27,24.13 0 top
R8  38.1,40.64 270 top
R9  36.83,33.02 90 top
R10  120.65,31.75 0 top
R11  115.57,21.59 0 top
R12  39.62,33.53 0 top
R13  114.3,28.45 90 bottom
TETHER  26.67,58.42 0 top
U3  48.26,38.1 0 top
U4  115.57,27.94 180 top

### Tracks (layer width: path | path; a pad name or v marks a point on that pad's centre or on a via)
5V_GND  (via drill 1)  (1 unrouted)
  Top 0.762: 123.68,5.57 122.94,4.83 122.94,2.54
  Top 2.794: CONVERSION.5@1 144.78,6.35 140.97,2.54 126.71,2.54 | 126.71,2.54 123.68,5.57 121.68,7.57 120.7,7.57 BACKPLANE_LOGIC.6 BACKPLANE_LOGIC.5 | 126.71,2.54 122.94,2.54 v100.33,2.54 v100.33,7.11
  pour Top: 133.86,8.64 134.37,9.14 135.13,9.14 136.14,8.13 136.14,4.06 135.38,3.3 134.37,3.3 133.86,3.81
  pour Bottom (isolate 0.61): 99.06,1.27 101.6,1.27 102.87,2.54 102.87,7.87 101.09,9.65 98.55,9.65 97.79,8.89 97.79,2.54
  pour Bottom (isolate 0.61): 143.51,7.62 144.78,6.35 155.7,6.35 162.05,12.7 144.78,12.7 143.51,11.43
12V_GND  (via drill 0.35)
  Top 0.203: U4.2 117.86,27.94 v118.36,28.45 118.78,28.86 Q6.2 120,31.55 R10.1 | U3.2 v44.45,38.1 | Q5.2 v36.18,39.62 36.23,39.62 R8.1 BRICK1.4@1 | R12.1 38.61,33.69 v38.61,35.31
  Bottom 0.203: 113.03,19.05 113.03,24.13 114.3,25.4 R13.1 117.51,27.6 v118.36,28.45 | v44.45,38.1 43.18,39.37 43.18,39.88 44.58,41.27 | 44.58,41.27 45.59,41.27 | 41.91,43.18 42.29,43.56 44.58,41.27 | v38.61,35.31 36.18,37.73 v36.18,39.62
  other vias: 66.04,49.53 66.04,46.99 71.12,46.99 71.12,49.53 72.39,49.53 72.39,46.99
  pour Bottom (isolate 0.61): 65.79,-5.08 101.6,-5.08 101.6,11.43 102.87,12.7 115.57,12.7 116.84,13.97 116.84,19.05 115.57,20.32 81.28,20.32 77.47,24.13 71.12,24.13 54.61,40.64 54.61,41.91 55.88,43.18 76.2,43.18 77.47,44.45 77.47,48.26 74.93,50.8 38.1,50.8 35.56,48.26 35.56,44.45 36.83,43.18 43.18,43.18 65.79,20.57
  pour Top: 64.77,50.8 74.93,50.8 74.93,44.45 64.77,44.45
  pour Top (no thermals): 66.04,-0.76 66.04,7.62 91.69,7.62 91.69,-0.76
48V_GND  (via drill 0.35)
  Top 0.203: JP1.1 97.64,53.24 v97.28,53.59
  pour Bottom (isolate 0.61): 25.22,63.5 23.11,61.4 23.11,50.29 -2.66,50.29 -2.66,64.65 10.16,77.47 148.59,77.47 160.02,66.04 160.02,22.86 151.13,13.97 133.6,13.97 131.06,16.51 131.06,34.04 127,38.1 127,42.95 118.11,52.07 113.03,52.07 112.27,51.31 92.71,51.31 91.95,52.07 74.93,52.07 72.39,54.61 72.39,62.23 71.12,63.5
  cutout Bottom: 133.35,49.53 146.05,49.53 146.05,44.45 133.35,44.45
  cutout Bottom: 138.43,59.18 138.43,56.64 143.51,56.64 143.51,59.18
  pour Bottom (isolate 0.61, no thermals): 73.66,57.15 73.66,54.61 74.93,53.34 88.9,53.34 90.17,54.61 90.17,57.15 88.9,58.42 74.93,58.42
  cutout Bottom (isolate 0.61, no thermals): 24.13,57.91 24.13,55.63 38.61,55.63 38.61,60.96 24.13,60.96
  pour Bottom (isolate 0.61): -2.54,52.83 22.86,52.83 22.86,42.93 -2.54,42.93
+3.3V  (via drill 0.35)
  Top 0.813: 130.81,16.51 130.81,19.05 | 130.81,21.59 130.81,19.05 | 130.81,21.59 130.81,22.86 129.54,24.13 R7.2 | BACKPLANE_LOGIC.4 115.57,8.13 117.09,9.65 123.7,9.65 127,6.35 v129.54,6.35 | v130.81,14.99 130.81,16.51 | 130.81,19.05 R5.2 | 130.81,21.59 R6.2 | 130.81,16.51 R4.2
  Bottom 0.813: v130.81,14.99 130.81,14.48 129.54,13.21 v129.54,6.35 130.81,5.08 139.7,5.08 142.24,7.62 CONVERSION.4
+5V  (1 unrouted)
  Top 2.794: CONVERSION.3@1 CONVERSION.3@2 | CONVERSION.3@3 CONVERSION.3@2 | BACKPLANE_LOGIC.1 BACKPLANE_LOGIC.2 BACKPLANE_LOGIC.3 113.08,7.67 113.08,8.98 116.29,12.19 138.43,12.19 CONVERSION.3@2
  pour Top: 130.56,10.92 130.56,6.6 131.06,6.1 132.33,6.1 132.84,6.6 132.84,11.68 131.32,11.68
+12V
  Top 0.203: 106.68,24.13 109.98,24.13 112.84,26.99 U4.6 U4.1 | 106.68,24.13 97.79,24.13 93.98,27.94 | 106.68,24.13 106.68,22.86 107.95,21.59 D8.A | D6.A 43.18,38.35 43.94,39.12 46.98,39.12 U3.1 U3.6 50.48,39.05 55.12,34.41 55.12,32.77
  Top 2.794: C3.+ 68.19,40.25 66.04,38.1 66.04,25.4
  pour Top (isolate 0.61, rank 2): 50.8,30.48 50.8,25.4 53.34,22.86 62.23,22.86 66.04,19.05 66.04,15.24 61.72,10.92 42.67,10.92 38.86,7.11 38.86,-5.08 64.01,-5.08 99.57,30.48 105.41,30.48 106.68,31.75 106.68,40.64 105.41,41.91 93.98,41.91 91.44,39.37 91.44,29.21 86.36,24.13 81.28,24.13 77.47,20.32 73.66,20.32 60.96,33.02 53.34,33.02
  pour Top: 62.23,30.48 66.04,30.48 66.04,27.94 63.5,27.94 63.5,29.21
  pour Bottom (no thermals): 39.12,-1.02 39.12,10.92 64.01,10.92 64.01,-1.02
+12V_A  (via drill 0.35)
  Top 0.203: 46.23,27.43 47.24,28.45 47.24,32.51 49.48,34.75 U3.4
  other vias: 41.66,22.86 45.47,22.86 45.21,26.67 43.69,26.67 42.16,26.67 42.93,27.69 44.45,27.69
  pour Top (isolate 0.61): 60.45,13.46 63.5,16.51 63.5,17.78 60.96,20.32 48.26,20.32 46.99,21.59 46.99,26.67 45.72,27.94 41.91,27.94 40.64,26.67 40.64,21.59 39.37,20.32 33.02,20.32 30.48,17.78 30.48,15.24 32.26,13.46
  pour Top (isolate 0.61, no thermals): 41.4,25.65 42.16,26.42 45.97,26.42 46.23,26.42 46.74,25.91 46.74,24.64 45.97,23.88 42.16,23.88 41.91,23.88 41.4,24.38
  pour Bottom (isolate 0.61): 60.2,13.46 63.5,16.76 63.5,18.03 60.96,20.57 48.26,20.57 46.99,21.84 46.99,26.92 45.72,28.19 41.91,28.19 40.64,26.92 40.64,21.84 39.37,20.57 33.02,20.57 30.48,18.03 30.48,15.49 32.51,13.46
+12V_B
  Top 0.203: Q4.2 113.03,39.37 114.3,38.1 114.3,31.75 113.03,30.48 113.03,29.21 113.35,28.89 U4.4
  pour Top (isolate 0.61): 117.35,50.29 90.17,50.29 88.9,49.02 88.9,44.7 90.17,43.43 106.43,43.43 107.95,41.91 107.95,38.1 109.22,36.83 111.76,36.83 113.03,38.1 113.03,41.91 115.57,44.45 118.11,44.45 119.38,45.72 119.38,48.26
+48V
  Top 0.203: Q8.3 117.51,32.67 118.11,33.27 118.11,36.58 129.29,47.75 | Q7.3 33.78,29.72 | D2.C 110.58,51.86 R3.2 110.58,56.81 | D10.C 103.12,53.73 103.12,55.12 | R1.2 86.61,59.69
  pour Top (isolate 0.61): 20.32,12.7 34.29,26.67 34.29,49.53 36.83,52.07 94.23,52.07 97.28,55.12 116.33,55.12 131.06,40.39 154.94,40.39 154.94,69.85 148.59,76.2 3.81,76.2 -2.54,69.85 -2.54,12.7
  cutout Top: 6.35,49.53 19.05,49.53 19.05,44.45 6.35,44.45
  cutout Top: 143.51,59.18 143.51,56.64 148.59,56.64 148.59,59.18
  cutout Top (isolate 0.61, no thermals): 38.86,60.96 38.86,55.63 54.86,55.63 54.86,60.96
ALERT_1  (via drill 0.35)
  Top 0.203: R5.1 v120.65,19.05 | BRICK1.D 71.12,35.56 72.39,36.83 v87.63,36.83
  Bottom 0.203: v87.63,36.83 88.9,38.1 119.38,38.1 125.48,32 125.48,26.42 120.65,21.59 v120.65,19.05 120.65,11.43 123.19,8.89 123.19,5.08 121.92,3.81 119.38,3.81 BACKPLANE_LOGIC.11
ALERT_2  (via drill 0.35)
  Top 0.203: R6.1 v121.92,21.59
  Bottom 0.203: BRICK2.D 86.36,34.29 86.36,38.1 87.63,39.37 119.38,39.37 126.49,32.26 126.49,26.16 v121.92,21.59 121.92,11.43 124.46,8.89 124.46,5.08 122.68,3.3 117.35,3.3 BACKPLANE_LOGIC.10
C2_1
  Bottom 0.203: BRICK1.A 71.12,26.67 69.85,26.67 68.58,27.94 68.58,34.29 76.2,41.91 119.38,41.91 128.52,32.77 128.52,25.65 124.46,21.59 124.46,11.43 127,8.89 127,5.08 124.21,2.29 113.28,2.29 BACKPLANE_LOGIC.8
C2_2  (via drill 0.35)
  Top 0.203: v86.36,43.18 v81.28,38.1
  Bottom 0.203: v86.36,43.18 119.38,43.18 129.54,33.02 129.54,25.4 125.73,21.59 125.73,11.43 128.27,8.89 128.27,5.08 124.97,1.78 111.25,1.78 BACKPLANE_LOGIC.7 | v81.28,38.1 78.74,35.56 BRICK2.A
CLK  (via drill 0.35)
  Top 0.203: R7.1 v125.73,24.13 | J1.1 80.26,42.67 v76.96,39.37
  Bottom 0.203: 85.09,39.37 86.36,40.64 119.38,40.64 127.51,32.51 127.51,25.91 v125.73,24.13 123.19,21.59 123.19,11.43 125.73,8.89 125.73,5.08 123.44,2.79 115.32,2.79 BACKPLANE_LOGIC.9 | 85.09,39.37 85.09,35.56 BRICK2.C | 85.09,39.37 v76.96,39.37 76.2,39.37 72.39,35.56 72.39,33.02 BRICK1.C
DATA  (via drill 0.35)
  Top 0.203: R4.1 v119.38,16.51 | v77.22,37.85 82.8,43.43 J1.2
  Bottom 0.203: BACKPLANE_LOGIC.12 121.92,6.35 121.92,8.89 119.38,11.43 v119.38,16.51 119.38,21.59 124.46,26.67 124.46,31.75 119.38,36.83 93.98,36.83 83.82,26.67 81.28,26.67 BRICK2.E BRICK1.E v77.22,37.85
GND_RAW
  pour Bottom (isolate 0.61): 57.15,60.96 58.42,62.23 68.58,62.23 69.85,60.96 69.85,55.88 68.58,54.61 58.42,54.61 57.15,55.88 40.64,55.88 39.37,57.15 39.37,59.69 40.64,60.96
LED_DRIVE_A
  Top 0.203: Q5.1 38.1,38.38 | 38.1,38.38 R8.2 | D5.A 40.24,38.38 38.1,38.38
LED_DRIVE_B
  Top 0.203: Q6.1 121.3,29.86 121.5,30.06 R10.2 121.5,32.68 119.89,34.29 D7.A
N$1  (via drill 0.35)
  Top 0.203: D2.A 107.19,51.82 v106.93,52.07
  Bottom 0.203: v106.93,52.07 D3.C
N$2
  Top 0.203: Q7.2 40.47,30.44 R12.2 40.47,35.85 D5.C
N$3  (via drill 0.35)
  Top 0.203: D7.C 116.89,34.29 116.85,34.26 116.85,31.51 116.44,31.1 Q8.2 115.17,31.1 v114.81,30.73
  Bottom 0.203: R13.2 114.3,30.23 v114.81,30.73
N$4
  Top 0.203: R9.2 Q5.3
N$5  (via drill 0.35)
  Top 0.203: R9.1 v36.83,30.48 | v43.18,34.29 D6.C
  Bottom 0.203: v36.83,30.48 40.64,30.48 43.18,33.02 v43.18,34.29
N$6
  Top 0.203: R11.2 118.11,21.59 120.65,24.13 Q6.3
N$7
  Top 0.203: R11.1 D8.C
ON/OFF  (via drill 0.35)
  Top 0.203: BRICK1.B 72.39,30.48 74.93,30.48 77.47,33.02 80.01,33.02 BRICK2.B 87.63,34.29 88.9,35.56 88.9,41.91 87.63,43.18 87.63,48.51 | 87.63,48.51 87.63,50.04 89.15,51.56 99.06,51.56 | 99.06,51.56 104.39,51.56 v106.17,53.34 106.43,53.59 R3.1 | JP1.2 99.06,51.56 | J2.1 87.63,48.51
  Bottom 0.203: v106.17,53.34 106.33,53.5 | Q2.3 105.16,54.36 v106.17,53.34 | v106.17,53.34 106.68,53.85 D4.C
ON/OFF_DRIVE  (via drill 0.35)
  Top 0.203: D10.A 101.07,53.71 v101.85,53.71
  Bottom 0.203: D9.C 100.83,53.71 v101.85,53.71 Q2.1
ON_DETECT
  Bottom 0.203: D3.A 98.42,52.07 | 98.42,52.07 R2.2 | D9.A 98.42,52.07
OR_DRIVE_A
  Top 0.203: U3.5 48.77,38.1 48.26,37.59 48.26,35.56 44.32,31.62 44.25,31.55 Q3.1 42.16,30.23 41.01,29.07 Q7.1
OR_DRIVE_B  (via drill 0.35)
  Top 0.203: 113.03,34.29 113.54,33.78 113.54,32.51 112.27,31.24 112.27,28.7 113.03,27.94 U4.5 | 113.03,34.29 Q4.1 | v113.03,35.56 113.03,34.29 | Q8.1 115.66,35.47 v115.57,35.56
  Bottom 0.203: v113.03,35.56 113.54,36.07 115.06,36.07 v115.57,35.56
REV_DRIVE  (via drill 0.35)
  Top 0.203: R1.1 82.55,59.69 v81.28,60.96
  Bottom 0.203: Q1.1 v81.28,60.96 81.4,60.96 D1.C
X
  cutout Bottom: 108.46,54.61 109.47,54.61 111.25,52.83 111.25,51.05 107.19,51.05 107.19,53.34
  cutout Top: 83.82,60.45 85.85,60.45 85.85,58.93 83.82,58.93

### Text on the board
tNames: + - | On/Off | CLK - DATA | ROV X13 Distribution v1 / Sam Kovnar / Read Hedl / Grant Geyer / January 9, 2021 | 12V_GND
tValues: +48V | 48V_GND | 48V_ETHERNET | +12V_B | LM74610 | LM74610 | +12V | 12V_GND | +12V_A
bValues: 12V_GND